# EAGLE design Fuente Alimentacion sin regulador (EAGLE 9.6.2)
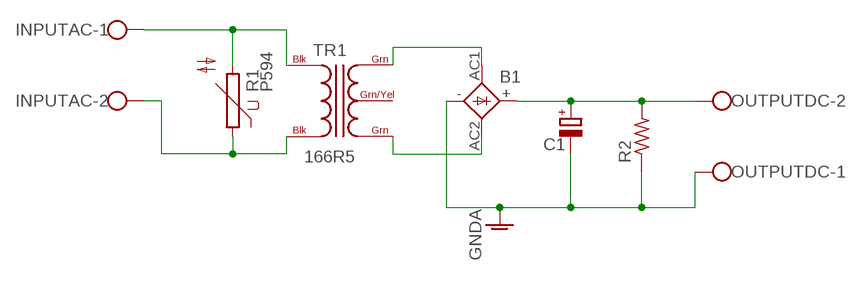
[diagram p0: schematic, sheet 1]

## Parts
B1  GBPC1  [GBPC1]
C1  CPOL-EU153CLV-1012  [153CLV-1012]
INPUTAC  W237-102  [W237-102]
OUTPUTDC  W237-102  [W237-102]
R1  P594  [P594]
R2  R-US_0207/10  [0207/10]
TR1  166R5  [C12H]

## Nets
GNDA: B1.- C1.- OUTPUTDC.1 R2.1
N$1: INPUTAC.1 R1.2 TR1.BLK@1(BLK)
N$2: INPUTAC.2 R1.1 TR1.BLK@2(BLK)
N$3: B1.AC1 TR1.GRN@1(GRN)
N$4: B1.AC2 TR1.GRN@2(GRN)
N$6: B1.+ C1.+ OUTPUTDC.2 R2.2
Unconnected: TR1.GRN/YEL

## Library data of the parts
B1 = rectifier:GBPC1: GENERAL INSTRUMENT RECTIFIER
C1 = rcl:CPOL-EU: POLARIZED CAPACITOR, European symbol; SPICEPREFIX: C
INPUTAC OUTPUTDC = con-wago-500:W237-102: WAGO SCREW CLAMP; MPN: 237-102; OC_FARNELL: unknown; OC_NEWARK: 70K9898
R1 = varistor:P594: VARISTOR
R2 = rcl:R-US_: RESISTOR, American symbol; SPICEPREFIX: R
TR1 = trafo-hammondmfg:166: OPEN STYLE FILAMENT & L.V. RECTIFIER USE TRANSFORMERS Economical single primnary 115VAC, 60 Hz or 117 VAC 50/60 Hz Source: Data sheet <http://www.hammondmfg.com/166.htm>

## Board
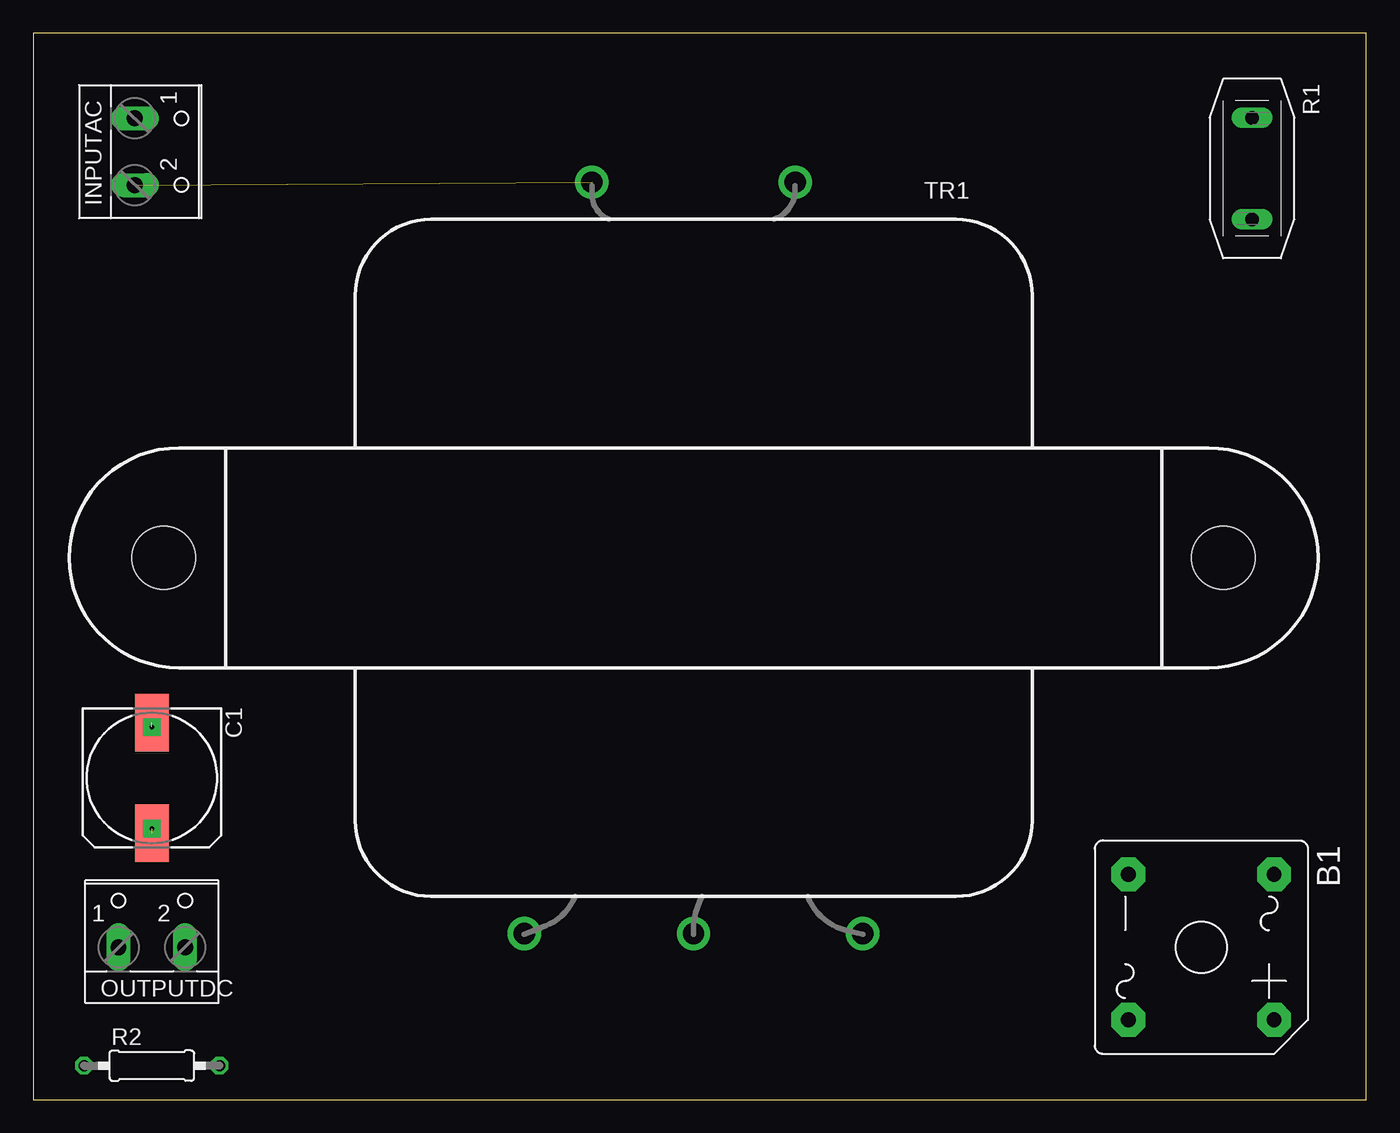
[diagram p1: board, top side]
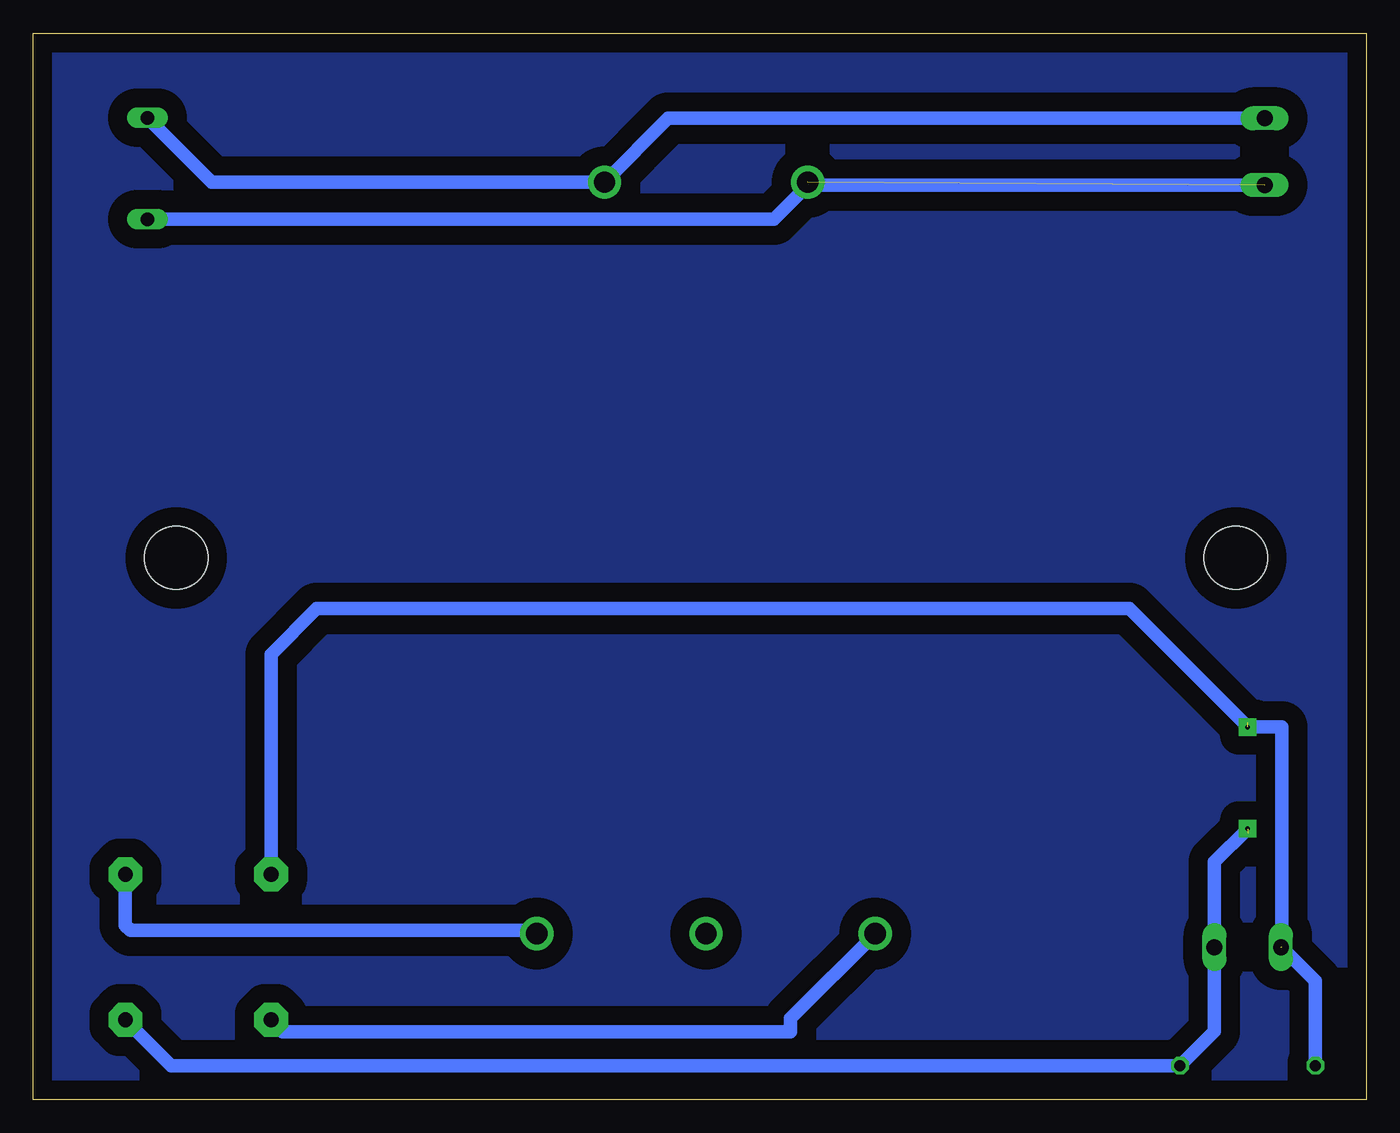
[diagram p2: board, bottom side, seen from below]

Size 100 x 80 mm. Coordinates in mm from the lower left corner, seen from the top.
Outline: 0,0 100,0 100,80 0,80 0,0
Copper layers (1*16): Top 0.035mm / dielectric 1.5mm / Bottom 0.035mm
Design rules "default": minimum track width 6mil, minimum drill 0.35mm, track to track 6mil, track to pad 6mil, pad to pad 6mil, via to via 6mil, smd to smd 6mil, copper to edge 40mil, drill to drill 6mil, minimum pad ring 10mil, minimum via ring 8mil, stop-mask expansion 4mil, vias tented up to drill 0mil, thermal gap 10mil

### Footprints (pad centres in the part's own frame; a part is rotated, then mirrored left to right if it is on the bottom)
GBPC1 = drill 1.118 pad 2.54 octagon: + 5.461,5.461; - -5.461,-5.461; AC1 -5.461,5.461; AC2 5.461,-5.461
153CLV-1012 = smd 4.3 x 2.5: + 4.15,0; - -4.15,0
W237-102 = drill 1.194 long: 1 -2.5,-1.27; 2 2.5,-1.27
P594 = drill 1.016 long: 1 0,3.81; 2 0,-3.81
0207/10 = drill 0.813 octagon: 1 -5.08,0; 2 5.08,0
C12H = drill 1.6 pad 2.5: BLK@1 -7.62,-28.195; BLK@2 7.62,-28.195; GRN/YEL 0,28.195; GRN@1 -12.7,28.195; GRN@2 12.7,28.195 | hole 4.75: 39.751,0; -39.751,0

### Placement (x,y rotation side)
B1  87.63,11.43 270 top
C1  8.89,24.13 270 top
INPUTAC  8.89,71.12 270 top
OUTPUTDC  8.89,12.7 0 top
R1  91.44,69.85 180 top
R2  8.89,2.54 0 top
TR1  49.53,40.64 180 top

### Tracks (layer width: path | path; a pad name or v marks a point on that pad's centre or on a via)
GND
  pour Bottom (isolate 1.422): 0,80.01 100.33,80.01 100.33,0 0,0
GNDA  (via drill 0.35 pad 1.3)  (2 unrouted)
  Bottom 1.016: B1.- 82.17,33.4 78.74,36.83 17.78,36.83 v8.89,27.94 6.35,27.94 6.35,11.47 OUTPUTDC.1 | R2.1 3.81,8.89 6.35,11.43
N$1
  Bottom 1.016: INPUTAC.1 52.37,73.62 TR1.BLK@1 86.61,68.83 R1.2
N$2  (1 unrouted)
  Bottom 1.016: INPUTAC.2 41.87,68.62 44.45,66.04 R1.1
N$3
  Bottom 1.016: TR1.GRN@1 62.48,12.7 92.71,12.7 93.09,13.08 B1.AC1
N$4
  Bottom 1.016: TR1.GRN@2 43.18,6.09 43.18,5.08 81.28,5.08 B1.AC2
N$6  (via drill 0.35 pad 1.3)  (1 unrouted)
  Bottom 1.016: B1.+ 89.66,2.54 R2.2 11.39,5.12 OUTPUTDC.2 11.39,17.82 v8.89,20.32